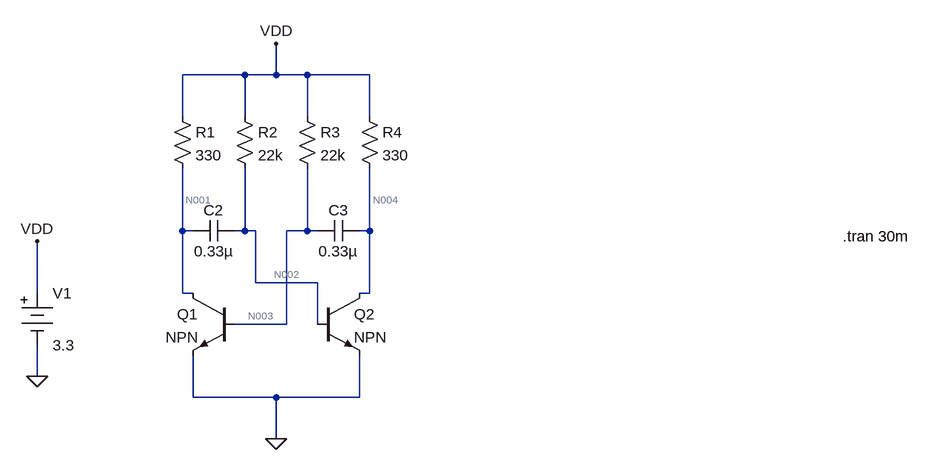
[diagram p0: schematic oscillator.asc]
oscillator.asc, the LTspice schematic file:
Version 4
SHEET 1 920 680
WIRE -128 -208 -224 -208
WIRE -80 -208 -80 -256
WIRE -80 -208 -128 -208
WIRE -32 -208 -80 -208
WIRE 64 -208 -32 -208
WIRE -224 -144 -224 -208
WIRE -128 -144 -128 -208
WIRE -32 -144 -32 -208
WIRE 64 -144 64 -208
WIRE -224 32 -224 -64
WIRE -208 32 -224 32
WIRE -128 32 -128 -64
WIRE -128 32 -144 32
WIRE -112 32 -128 32
WIRE -32 32 -32 -64
WIRE -32 32 -64 32
WIRE -16 32 -32 32
WIRE 64 32 64 -64
WIRE 64 32 48 32
WIRE -112 112 -112 32
WIRE -16 112 -112 112
WIRE -448 128 -448 48
WIRE -224 128 -224 32
WIRE -208 128 -224 128
WIRE 64 128 64 32
WIRE 64 128 48 128
WIRE -64 176 -64 32
WIRE -64 176 -144 176
WIRE -16 176 -16 112
WIRE -448 256 -448 208
WIRE -208 288 -208 224
WIRE -80 288 -208 288
WIRE 48 288 48 224
WIRE 48 288 -80 288
WIRE -80 352 -80 288
FLAG -448 256 0
FLAG -448 48 VDD
FLAG -80 -256 VDD
FLAG -80 352 0
SYMBOL Misc\\battery -448 112 R0
WINDOW 123 0 0 Left 0
WINDOW 39 0 0 Left 0
SYMATTR InstName V1
SYMATTR Value 3.3
SYMBOL npn -144 128 M0
SYMATTR InstName Q1
SYMBOL npn -16 128 R0
SYMATTR InstName Q2
SYMBOL cap -144 16 R90
WINDOW 0 0 32 VBottom 2
WINDOW 3 32 32 VTop 2
SYMATTR InstName C2
SYMATTR Value 0.33µ
SYMBOL cap 48 16 R90
WINDOW 0 0 32 VBottom 2
WINDOW 3 32 32 VTop 2
SYMATTR InstName C3
SYMATTR Value 0.33µ
SYMBOL res -240 -160 R0
SYMATTR InstName R1
SYMATTR Value 330
SYMBOL res -144 -160 R0
SYMATTR InstName R2
SYMATTR Value 22k
SYMBOL res -48 -160 R0
SYMATTR InstName R3
SYMATTR Value 22k
SYMBOL res 48 -160 R0
SYMATTR InstName R4
SYMATTR Value 330
TEXT 792 40 Left 2 !.tran 30m

The netlist it stands for:
* oscillator.asc
V1 VDD 0 3.3
Q1 N001 N003 0 0 NPN
Q2 N004 N002 0 0 NPN
C2 N002 N001 0.33µ
C3 N004 N003 0.33µ
R1 VDD N001 330
R2 VDD N002 22k
R3 VDD N003 22k
R4 VDD N004 330
.model NPN NPN
.model PNP PNP
.lib standard.bjt
.tran 30m
.backanno
.end

* Results of the author's LTspice run, read from the files saved beside the schematic
* Operating Point, zero values left out:
*   V(vdd) = 3.3 V
*   V(n001) = 164 mV
*   V(n003) = 832.6 mV
*   V(n004) = 164 mV
*   V(n002) = 832.6 mV
*   Ic(Q2) = 9.503 mA
*   Ib(Q2) = 112.2 µA
*   Ie(Q2) = -9.615 mA
*   Ic(Q1) = 9.503 mA
*   Ib(Q1) = 112.2 µA
*   Ie(Q1) = -9.615 mA
*   I(R4) = 9.503 mA
*   I(R3) = 112.2 µA
*   I(R2) = 112.2 µA
*   I(R1) = 9.503 mA
*   I(V1) = -19.23 mA